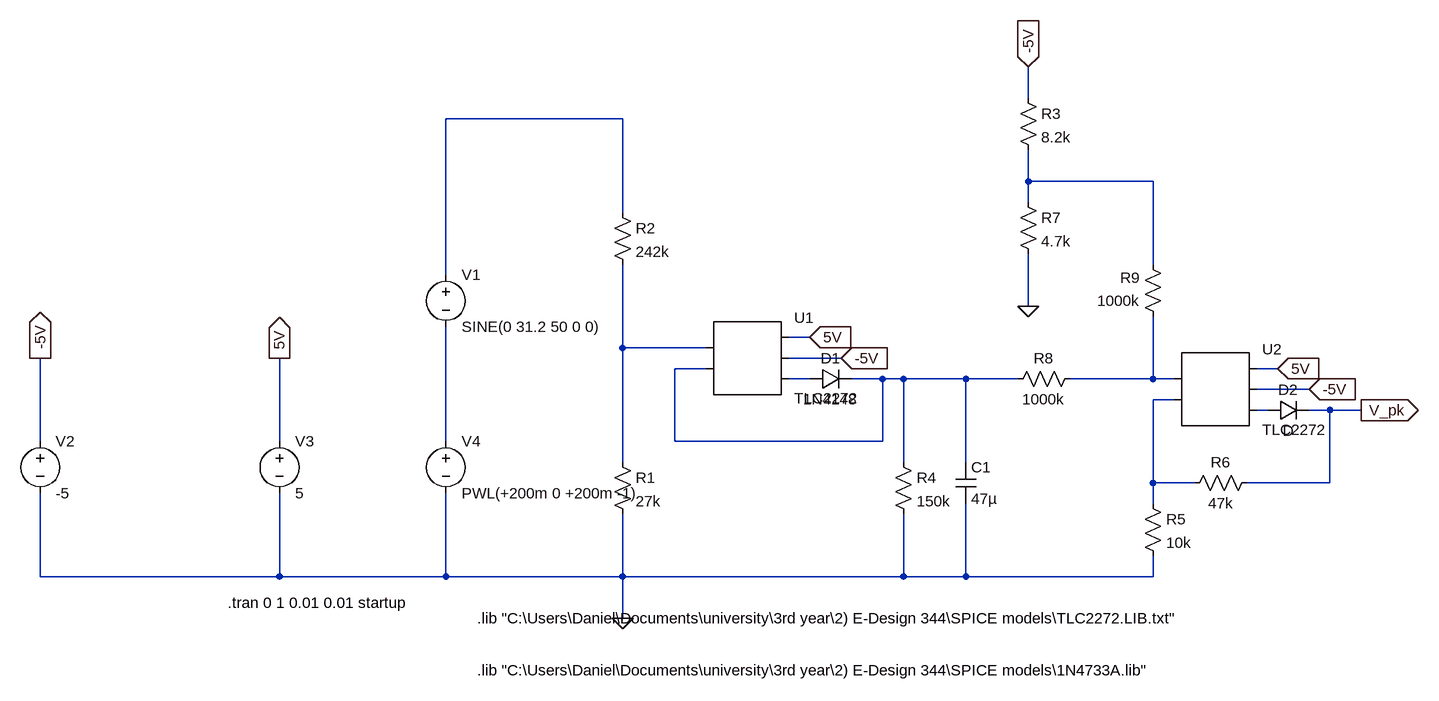
[diagram p0: schematic VoltageTransducer.asc]
VoltageTransducer.asc, the LTspice schematic file:
Version 4
SHEET 1 4068 912
WIRE 1792 16 1792 -32
WIRE 1168 48 896 48
WIRE 1792 144 1792 96
WIRE 1984 144 1792 144
WIRE 1792 176 1792 144
WIRE 1168 192 1168 48
WIRE 1984 272 1984 144
WIRE 896 288 896 48
WIRE 1792 336 1792 256
WIRE 1456 384 1424 384
WIRE 1168 400 1168 272
WIRE 1296 400 1168 400
WIRE 1504 416 1424 416
WIRE 1296 432 1248 432
WIRE 2176 432 2144 432
WIRE 1456 448 1424 448
WIRE 1568 448 1520 448
WIRE 1600 448 1568 448
WIRE 1696 448 1600 448
WIRE 1776 448 1696 448
WIRE 1984 448 1984 352
WIRE 1984 448 1856 448
WIRE 2016 448 1984 448
WIRE 2224 464 2144 464
WIRE 2016 480 1984 480
WIRE 2160 496 2144 496
WIRE 2256 496 2224 496
WIRE 2304 496 2256 496
WIRE 272 544 272 416
WIRE 640 544 640 416
WIRE 896 544 896 368
WIRE 1248 544 1248 432
WIRE 1568 544 1568 448
WIRE 1568 544 1248 544
WIRE 1168 576 1168 400
WIRE 1600 576 1600 448
WIRE 1696 576 1696 448
WIRE 1984 608 1984 480
WIRE 2048 608 1984 608
WIRE 2256 608 2256 496
WIRE 2256 608 2128 608
WIRE 1984 640 1984 608
WIRE 272 752 272 624
WIRE 640 752 640 624
WIRE 640 752 272 752
WIRE 896 752 896 624
WIRE 896 752 640 752
WIRE 1168 752 1168 656
WIRE 1168 752 896 752
WIRE 1600 752 1600 656
WIRE 1600 752 1168 752
WIRE 1696 752 1696 640
WIRE 1696 752 1600 752
WIRE 1984 752 1984 720
WIRE 1984 752 1696 752
WIRE 1168 816 1168 752
FLAG 1168 816 0
FLAG 640 416 5V
IOPIN 640 416 Out
FLAG 272 416 -5V
IOPIN 272 416 Out
FLAG 1504 416 -5V
IOPIN 1504 416 In
FLAG 2224 464 -5V
IOPIN 2224 464 In
FLAG 1456 384 5V
IOPIN 1456 384 In
FLAG 2176 432 5V
IOPIN 2176 432 In
FLAG 2304 496 V_pk
IOPIN 2304 496 Out
FLAG 1792 -32 -5V
IOPIN 1792 -32 In
FLAG 1792 336 0
SYMBOL voltage 896 272 R0
WINDOW 123 0 0 Left 2
WINDOW 39 0 0 Left 2
SYMATTR InstName V1
SYMATTR Value SINE(0 31.2 50 0 0)
SYMBOL cap 1680 576 R0
SYMATTR InstName C1
SYMATTR Value 47µ
SYMBOL AutoGenerated\\TLC2272 1360 416 R0
SYMATTR InstName U1
SYMBOL diode 1456 464 R270
WINDOW 0 32 32 VTop 2
WINDOW 3 0 32 VBottom 2
SYMATTR InstName D1
SYMATTR Value 1N4148
SYMBOL voltage 272 528 R0
WINDOW 123 0 0 Left 2
WINDOW 39 0 0 Left 2
SYMATTR InstName V2
SYMATTR Value -5
SYMBOL voltage 640 528 R0
WINDOW 123 0 0 Left 2
WINDOW 39 0 0 Left 2
SYMATTR InstName V3
SYMATTR Value 5
SYMBOL AutoGenerated\\TLC2272 2080 464 R0
SYMATTR InstName U2
SYMBOL res 1584 560 R0
SYMATTR InstName R4
SYMATTR Value 150k
SYMBOL res 1968 624 R0
SYMATTR InstName R5
SYMATTR Value 10k
SYMBOL res 2032 624 R270
WINDOW 0 32 56 VTop 2
WINDOW 3 0 56 VBottom 2
SYMATTR InstName R6
SYMATTR Value 47k
SYMBOL res 1776 0 R0
SYMATTR InstName R3
SYMATTR Value 8.2k
SYMBOL res 1776 160 R0
SYMATTR InstName R7
SYMATTR Value 4.7k
SYMBOL res 1872 432 R90
WINDOW 0 0 56 VBottom 2
WINDOW 3 32 56 VTop 2
SYMATTR InstName R8
SYMATTR Value 1000k
SYMBOL res 2000 368 R180
WINDOW 0 36 76 Left 2
WINDOW 3 36 40 Left 2
SYMATTR InstName R9
SYMATTR Value 1000k
SYMBOL res 1152 560 R0
SYMATTR InstName R1
SYMATTR Value 27k
SYMBOL res 1152 176 R0
SYMATTR InstName R2
SYMATTR Value 242k
SYMBOL voltage 896 528 R0
WINDOW 123 0 0 Left 2
WINDOW 39 0 0 Left 2
SYMATTR InstName V4
SYMATTR Value PWL(+200m 0 +200m -1)
SYMBOL diode 2160 512 R270
WINDOW 0 32 32 VTop 2
WINDOW 3 0 32 VBottom 2
SYMATTR InstName D2
TEXT 560 792 Left 2 !.tran 0 1 0.01 0.01 startup
TEXT 944 816 Left 2 !.lib "C:\\Users\\Daniel\\Documents\\university\\3rd year\\2) E-Design 344\\SPICE models\\TLC2272.LIB.txt"
TEXT 944 896 Left 2 !.lib "C:\\Users\\Daniel\\Documents\\university\\3rd year\\2) E-Design 344\\SPICE models\\1N4733A.lib"

The netlist it stands for:
* VoltageTransducer.asc
V1 N001 N009 SINE(0 31.2 50 0 0)
C1 N004 0 47µ
* U1: TLC2272 (symbol AutoGenerated\TLC2272 not available, pins judged from their places): pin1=N003 pin2=N004 pin3=5V pin4=-5V pin5=N005
D1 N005 N004 1N4148
V2 -5V 0 -5
V3 5V 0 5
* U2: TLC2272 (symbol AutoGenerated\TLC2272 not available, pins judged from their places): pin1=N006 pin2=N007 pin3=5V pin4=-5V pin5=N008
R4 N004 0 150k
R5 N007 0 10k
R6 N007 V_pk 47k
R3 -5V N002 8.2k
R7 N002 0 4.7k
R8 N006 N004 1000k
R9 N006 N002 1000k
R1 N003 0 27k
R2 N001 N003 242k
V4 N009 0 PWL(+200m 0 +200m -1)
D2 N008 V_pk D
.model D D
.lib standard.dio
.tran 0 1 0.01 0.01 startup
.lib "C:\Users\Daniel\Documents\university\3rd year\2) E-Design 344\SPICE models\TLC2272.LIB.txt"
.lib "C:\Users\Daniel\Documents\university\3rd year\2) E-Design 344\SPICE models\1N4733A.lib"
.backanno
.end